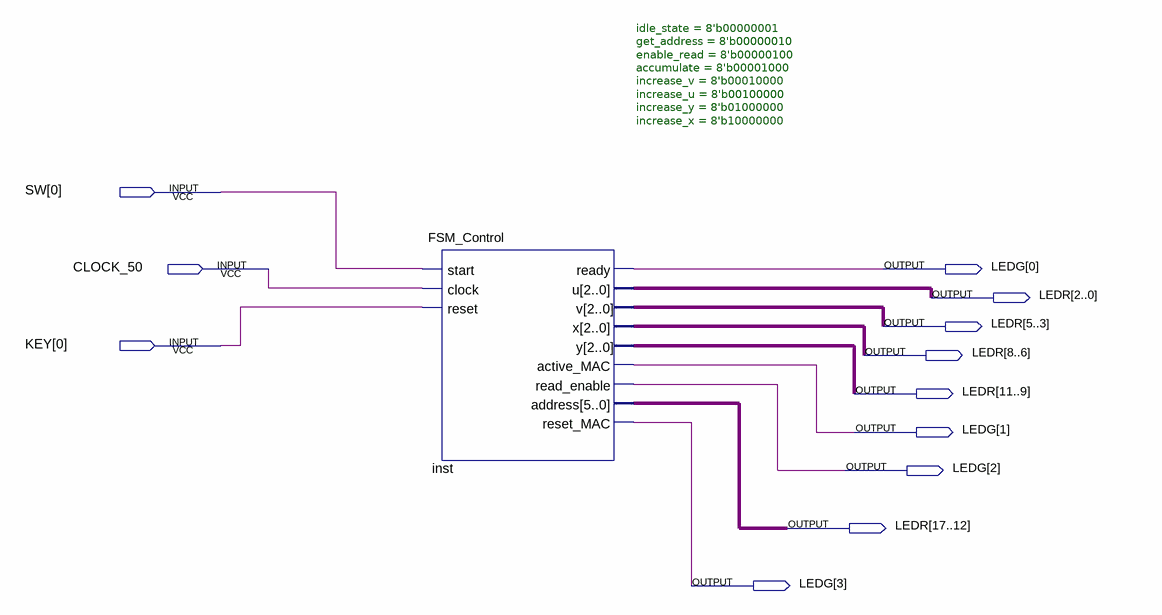
[diagram p0: schematic sheet]
// Quartus schematic Q3.bdf as structural Verilog: 1 symbols, 12 pins
module Q3 (
  input  [0:0] SW,
  input  CLOCK_50,
  input  [0:0] KEY,
  output [3:0] LEDG,
  output [17:0] LEDR
);

  FSM_Control #(.idle_state(8'b00000001), .get_address(8'b00000010), .enable_read(8'b00000100), .accumulate(8'b00001000), .increase_v(8'b00010000), .increase_u(8'b00100000), .increase_y(8'b01000000), .increase_x(8'b10000000)) inst (
    .start(SW[0]), .clock(CLOCK_50), .reset(KEY[0]), .ready(LEDG[0]), .u(LEDR[2:0]), .v(LEDR[5:3]),
    .x(LEDR[8:6]), .y(LEDR[11:9]), .active_MAC(LEDG[1]), .read_enable(LEDG[2]), .address(LEDR[17:12]),
    .reset_MAC(LEDG[3]));
endmodule
